# Altium schematic sheet Sheet_1_2024-11-08.schdoc
size 311 x 200 mm
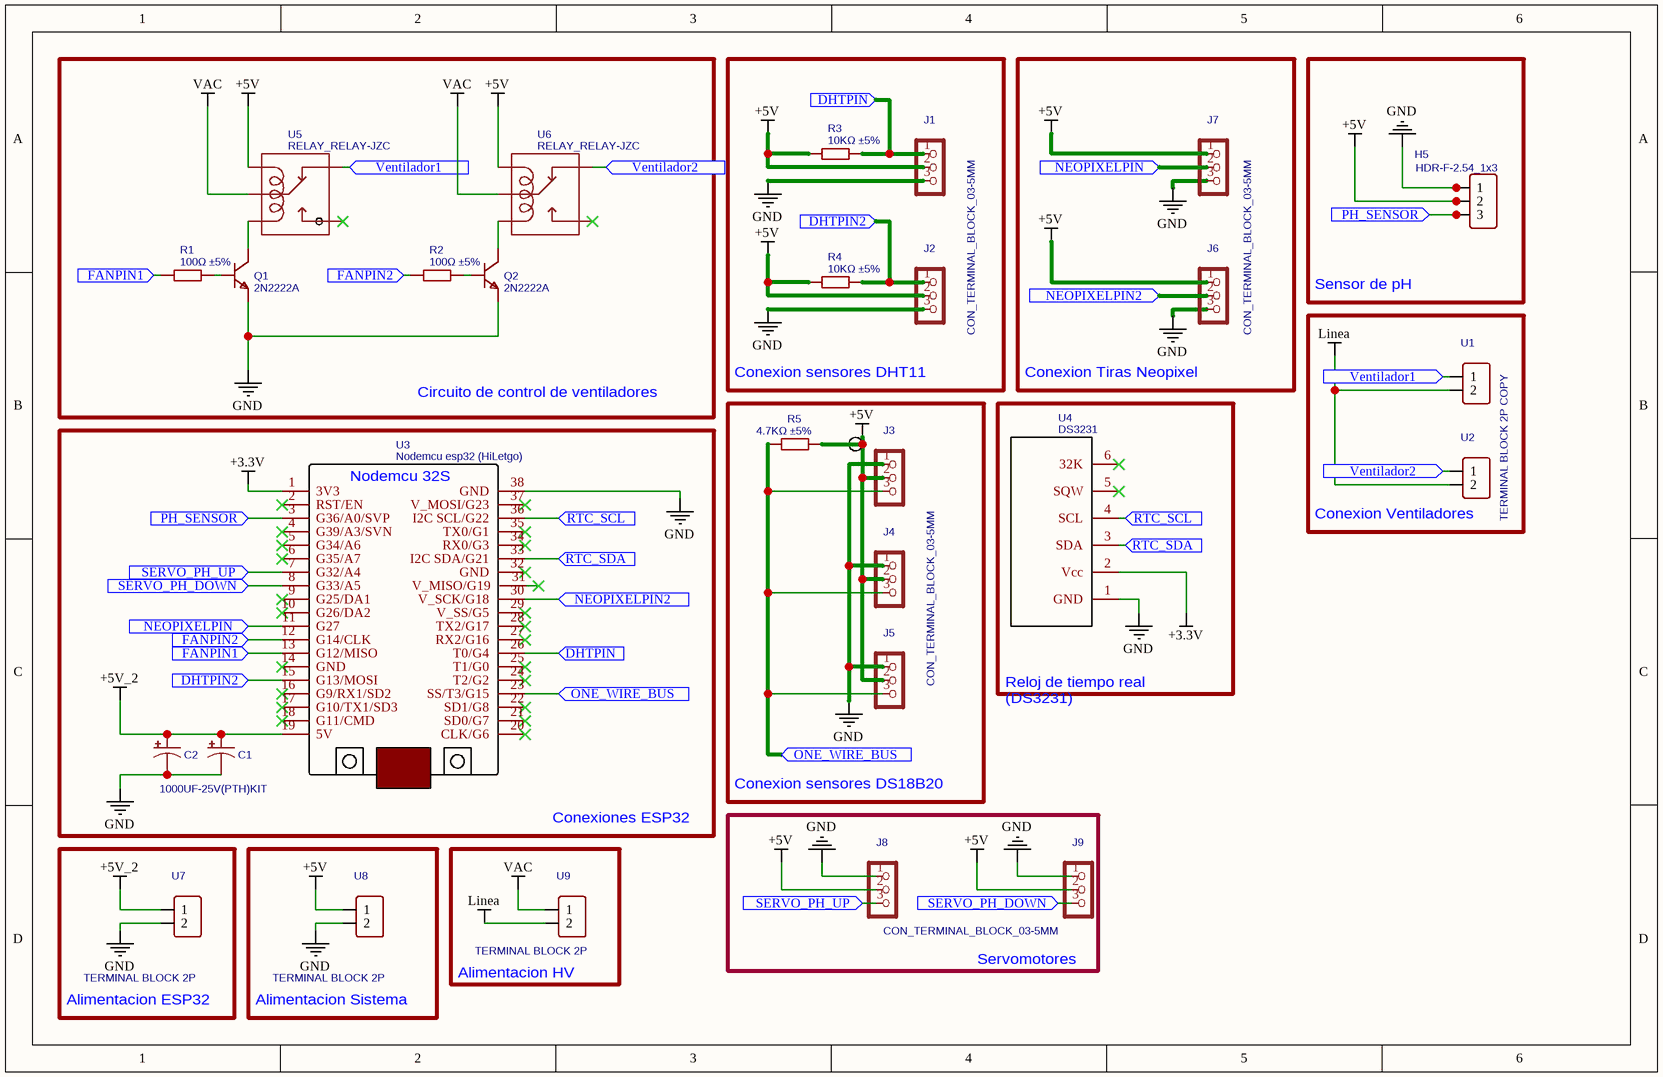
[diagram p0: Sheet_1_2024-11-08.schdoc]

## Parts
C1  1000UF-25V(PTH)KIT  [CPOL-RADIAL-1000UF-25V-KIT]  (value not drawn)
C2  1000UF-25V(PTH)KIT  [CPOL-RADIAL-1000UF-25V-KIT]
H5  HDR-F-2.54_1x3  [HDR-F-2.54_1X3]
J1  CON_TERMINAL_BLOCK_03-5MM  [TERMINAL_BLOCK_3P_5]  (value not drawn)
J2  CON_TERMINAL_BLOCK_03-5MM  [TERMINAL_BLOCK_3P_5]
J3  CON_TERMINAL_BLOCK_03-5MM  [TERMINAL_BLOCK_3P_5]  (value not drawn)
J4  CON_TERMINAL_BLOCK_03-5MM  [TERMINAL_BLOCK_3P_5]  (value not drawn)
J5  CON_TERMINAL_BLOCK_03-5MM  [TERMINAL_BLOCK_3P_5]
J6  CON_TERMINAL_BLOCK_03-5MM  [TERMINAL_BLOCK_3P_5]
J7  CON_TERMINAL_BLOCK_03-5MM  [TERMINAL_BLOCK_3P_5]  (value not drawn)
J8  CON_TERMINAL_BLOCK_03-5MM  [TERMINAL_BLOCK_3P_5]
J9  CON_TERMINAL_BLOCK_03-5MM  [TERMINAL_BLOCK_3P_5]  (value not drawn)
Q1  2N2222A  [2N222A OH]
Q2  2N2222A  [2N222A OH]
R1  100Ω ±5%  [RESISTANCE 10K]
R2  100Ω ±5%  [RESISTANCE 10K]
R3  10KΩ ±5%  [RESISTANCE 10K]
R4  10KΩ ±5%  [RESISTANCE 10K]
R5  4.7KΩ ±5%  [RESISTANCE 10K]
U1  TERMINAL BLOCK 2P COPY  [BORNERA DOS TERMINALES TERMINAL BLOCK 5MM]
U2  TERMINAL BLOCK 2P COPY  [BORNERA DOS TERMINALES TERMINAL BLOCK 5MM]  (value not drawn)
U3  Nodemcu esp32 (HiLetgo)  [HILETGO-NODEMCU-ESP32S]
U4  DS3231  [DS3231]
U5  RELAY_RELAY-JZC  [SHORI S7 RELAY]
U6  RELAY_RELAY-JZC  [SHORI S7 RELAY]
U7  TERMINAL BLOCK 2P  [BORNERA DOS TERMINALES TERMINAL BLOCK 5MM]
U8  TERMINAL BLOCK 2P  [BORNERA DOS TERMINALES TERMINAL BLOCK 5MM]
U9  TERMINAL BLOCK 2P  [BORNERA DOS TERMINALES TERMINAL BLOCK 5MM]

## Blocks framed on the sheet
Circuito de control de ventiladores: Q1 Q2 R1 R2 U5 U6
Conexion sensores DHT11: J1 J2 R3 R4
Conexion Tiras Neopixel: J6 J7
Sensor de pH: H5
Conexion Ventiladores: U1 U2
Conexiones ESP32: C1 C2 U3
Conexion sensores DS18B20: J3-J5 R5
Servomotores: J8 J9
Alimentacion ESP32: U7
Alimentacion Sistema: U8
Alimentacion HV: U9

## Ports
DHTPIN2 (in), DHTPIN (in), FANPIN1 (in), FANPIN2 (in), NEOPIXELPIN2 (in), NEOPIXELPIN (in), ONE_WIRE_BUS (in), PH_SENSOR (in), RTC_SCL (in), RTC_SDA (in), SERVO_PH_DOWN (in), SERVO_PH_UP (in), Ventilador1 (in), Ventilador2 (in)

## Nets
+3.3V: U3.1(3V3) U4.2(Vcc)
+5V: H5.2 J1.2 J2.2 J3.2 J4.2 J5.2 J6.1 J7.1 J8.2 J9.2 R3.1 R4.1 R5.2 U5.1(COIL1) U6.1(COIL1) U8.1
+5V_2: C1.+ C2.+ U3.19(5V) U7.1
GND: C1.- C2.- H5.1 J1.3 J2.3 J3.1 J4.1 J5.1 J6.3 J7.3 J8.1 J9.1 Q1.3(E) Q2.3(E) U3.38(GND) U4.1(GND) U7.2 U8.2
Linea: U1.2 U2.2 U9.2
VAC: U5.4(MAIN) U6.4(MAIN) U9.1
DHTPIN: J1.1 R3.2 U3.26(T0/G4) ; port DHTPIN
DHTPIN2: J2.1 R4.2 U3.15(G13/MOSI) ; port DHTPIN2
FANPIN1: R1.1 U3.13(G12/MISO) ; port FANPIN1
FANPIN2: R2.1 U3.12(G14/CLK) ; port FANPIN2
NEOPIXELPIN: J7.2 U3.11(G27) ; port NEOPIXELPIN
NEOPIXELPIN2: J6.2 U3.30(V_SCK/G18) ; port NEOPIXELPIN2
ONE_WIRE_BUS: J3.3 J4.3 J5.3 R5.1 U3.23(SS/T3/G15) ; port ONE_WIRE_BUS
PH_SENSOR: H5.3 U3.3(G36/A0/SVP) ; port PH_SENSOR
RTC_SCL: U3.36(I2C_SCL/G22) U4.4(SCL) ; port RTC_SCL
RTC_SDA: U3.33(I2C_SDA/G21) U4.3(SDA) ; port RTC_SDA
SERVO_PH_DOWN: J9.3 U3.8(G33/A5) ; port SERVO_PH_DOWN
SERVO_PH_UP: J8.3 U3.7(G32/A4) ; port SERVO_PH_UP
Ventilador1: U1.1 U5.14(NC) ; port Ventilador1
Ventilador2: U2.1 U6.14(NC) ; port Ventilador2
NetQ1_1: Q1.1(C) U5.2(COIL2)
NetQ1_2: Q1.2(B) R1.2
NetQ2_1: Q2.1(C) U6.2(COIL2)
NetQ2_2: Q2.2(B) R2.2

Not connected (* = marked no-connect by the designer): U3 2(RST/EN)* 4(G39/A3/SVN)* 5(G34/A6)* 6(G35/A7)* 9(G25/DA1)* 10(G26/DA2)* 14(GND)* 16(G9/RX1/SD2)* 17(G10/TX1/SD3)* 18(G11/CMD)* 20(CLK/G6)* 21(SD0/G7)* 22(SD1/G8)* 24(T2/G2)* 25(T1/G0)* 27(RX2/G16)* 28(TX2/G17)* 29(V_SS/G5)* 31(V_MISO/G19)* 32(GND)* 34(RX0/G3)* 35(TX0/G1)* 37(V_MOSI/G23)*; U4 5(SQW)* 6(32K)*; U5 3(NO)*; U6 3(NO)*

## Notes on the sheet
- Reloj de tiempo real
  (DS3231)
- (in symbol Nodemcu esp32 (HiLetgo)) Nodemcu 32S

## Library data of the parts
C1 C2 = 1000UF-25V(PTH)KIT: description: CAP-08070; Contributor: SparkFun; spicePre: C; spiceSymbolName: 1000UF-25V(PTH)KIT
H5 = HDR-F-2.54_1x3: Contributor: LCEDA_Lib; BOM_Supplier Part: C146690; BOM_Supplier: LCSC; spicePre: H; spiceSymbolName: HDR-F-2.54_1x3
J1-J9 = CON_TERMINAL_BLOCK_03-5MM: description: 3 poles, wire to board connector; Contributor: DangerousPrototype; spicePre: J; spiceSymbolName: CON_TERMINAL_BLOCK_03-5MM
Q1 Q2 = 2N2222A: BOM_Manufacturer: Foshan Blue Rocket Elec; Contributor: som3a elshayeb; BOM_Supplier: LCSC; BOM_Supplier Part: C358533; BOM_Manufacturer Part: 2N2222A; spicePre: Q; spiceSymbolName: 2N2222A OH
R1 R2 = 100Ω ±5%: BOM_Manufacturer: Nanjing Shiheng Elec; BOM_Manufacturer Part: MF58 103J3470; nameAlias: Value; Contributor: Evgeniy_ANP; BOM_Supplier: LCSC; BOM_Supplier Part: C123392; BOM_JLCPCB Part Class: Extended Part; spicePre: R; spiceSymbolName: RESISTANCE_10k
R3 R4 = 10KΩ ±5%: BOM_Manufacturer: Nanjing Shiheng Elec; BOM_Manufacturer Part: MF58 103J3470; nameAlias: Value; Contributor: Evgeniy_ANP; BOM_Supplier: LCSC; BOM_Supplier Part: C123392; BOM_JLCPCB Part Class: Extended Part; spicePre: R; spiceSymbolName: RESISTANCE_10k
R5 = 4.7KΩ ±5%: BOM_Manufacturer: Nanjing Shiheng Elec; BOM_Manufacturer Part: MF58 103J3470; nameAlias: Value; Contributor: Evgeniy_ANP; BOM_Supplier: LCSC; BOM_Supplier Part: C123392; BOM_JLCPCB Part Class: Extended Part; spicePre: R; spiceSymbolName: RESISTANCE_10k
U1 U2 = TERMINAL BLOCK 2P COPY: Contributor: malakathushan; spicePre: U; spiceSymbolName: TERMINAL BLOCK 2P COPY
U3 = Nodemcu esp32 (HiLetgo): Contributor: j_dalrym2; BOM_Manufacturer Part: Nodemcu esp32 (HiLetgo); spicePre: U; spiceSymbolName: Nodemcu esp32 (HiLetgo)
U4 = DS3231: Contributor: mwneal2014; spicePre: U; spiceSymbolName: DS3231
U7-U9 = TERMINAL BLOCK 2P: Contributor: malakathushan; spicePre: U; spiceSymbolName: TERMINAL BLOCK 2P COPY
U5 U6 = RELAY_RELAY-JZC: timeStamp: 1461595408; spicePre: U; spiceSymbolName: RELAY_RELAY-JZC